# Altium schematic sheet Power.SchDoc
size A4; SheetNumber: 4; SheetTotal: 6
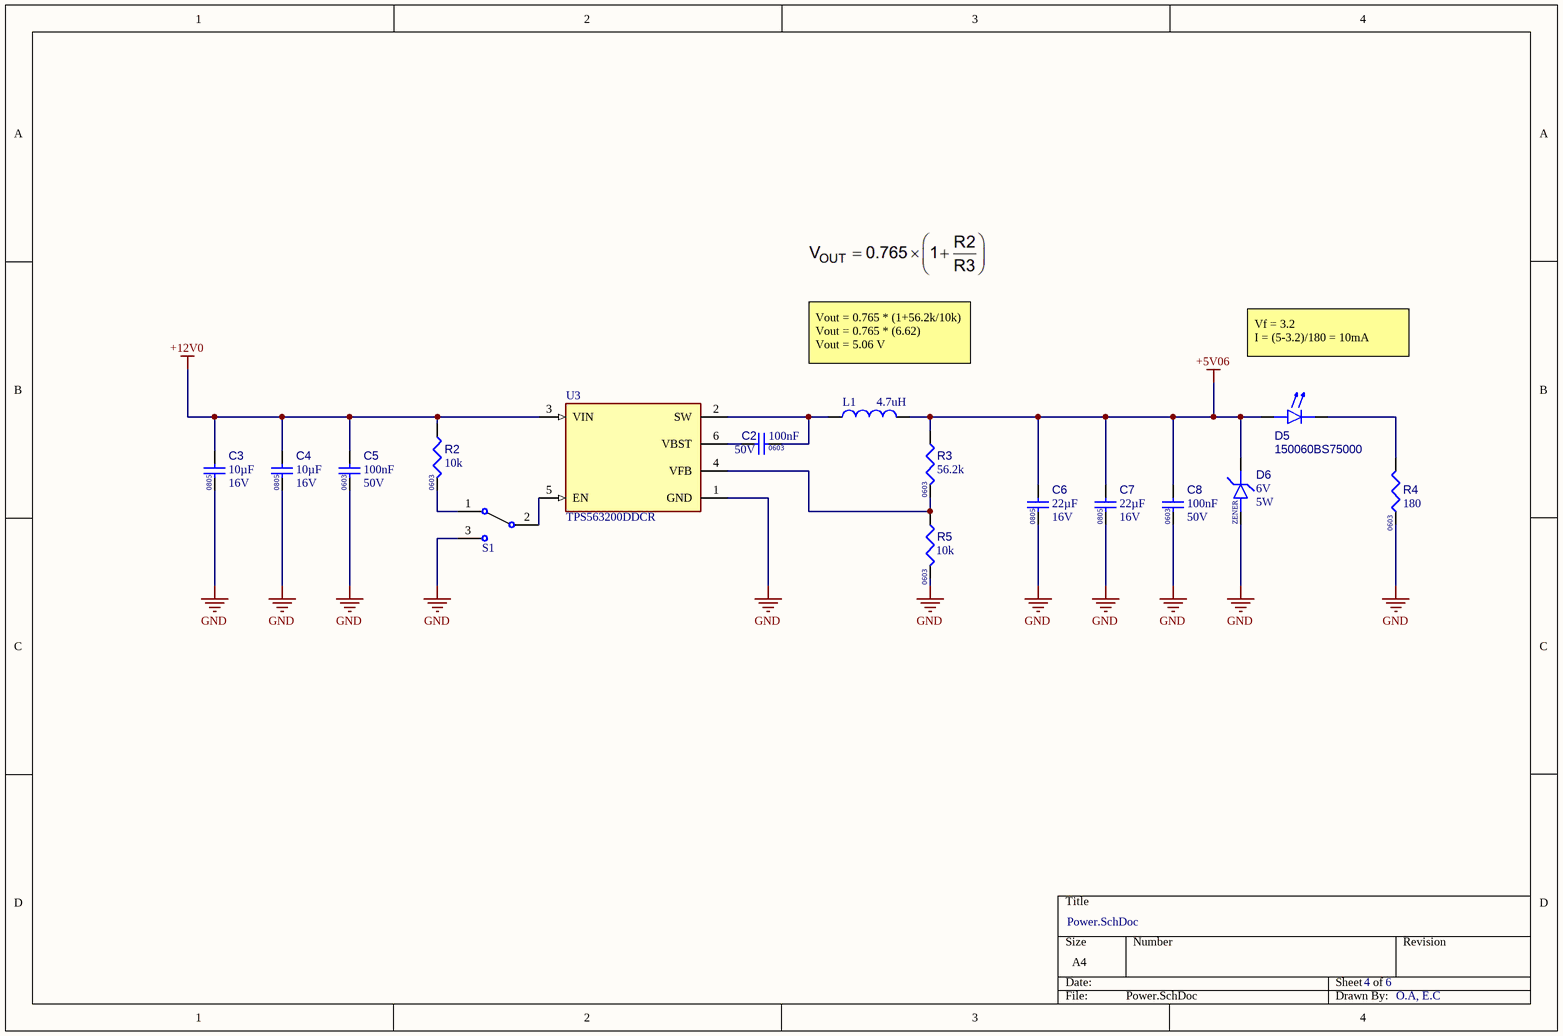
[diagram p0: Power.SchDoc]

## Parts
C2  value 100nF  Voltage Rating: 50V  Case/Package: 0603  [CAPC1608X90X40NL10T20]  (hidden comment: Capacitor 100 nF +/-10% 50 V 0603)
C3  value 10µF  Voltage Rating: 16V  Case/Package: 0805  [CAP CER 10UF 16V X5R 0805-Footprint-1]  (hidden comment: CAP CER 10UF 16V X5R 0805)
C4  value 10µF  Voltage Rating: 16V  Case/Package: 0805  [CAP CER 10UF 16V X5R 0805-Footprint-1]  (hidden comment: CAP CER 10UF 16V X5R 0805)
C5  value 100nF  Voltage Rating: 50V  Case/Package: 0603  [CAPC1608X90X40NL10T20]  (hidden comment: Capacitor 100 nF +/-10% 50 V 0603)
C6  value 22µF  Voltage Rating: 16V  Case/Package: 0805  [CL21A226MOQNNNE-Footprint-1]  (hidden comment: CL21A226MOQNNNE)
C7  value 22µF  Voltage Rating: 16V  Case/Package: 0805  [CL21A226MOQNNNE-Footprint-1]  (hidden comment: CL21A226MOQNNNE)
C8  value 100nF  Voltage Rating: 50V  Case/Package: 0603  [CAPC1608X90X40NL10T20]  (hidden comment: Capacitor 100 nF +/-10% 50 V 0603)
D5  150060BS75000  [WL-SMCW_0603_150060xx75000]
D6  Reference Voltage-Nom: 6V  Max Power Dissipation: 5W  Diode Type: ZENER  [FP-DO-214AA-MFG]  (hidden comment: SMBJ5340B-TP)
L1  Inductance-Nom (L): 4.7uH  [FP-LQH5BPN_38-MFG]  (hidden comment: LQH5BPN4R7N38L)
R2  value 10k  Case/Package: 0603  [RESC1608X55X25NL10T15]  (hidden comment: Resistor 10k +/-1% 0603 100 mW)
R3  value 56.2k  Case/Package: 0603  [RC0603JR-0730KL-Footprint-1]  (hidden comment: RC0603FR-0756K2L)
R4  value 180  Case/Package: 0603  [RESC0603(1608)_N]  (hidden comment: RC0603JR-07180RL)
R5  value 10k  Case/Package: 0603  [RESC1608X55X25NL10T15]  (hidden comment: Resistor 10k +/-1% 0603 100 mW)
S1  SLW-883935-2A-D  [SLW-883935-2A-D-Footprint-1]  (value not drawn)
U3  TPS563200DDCR  [FP-DDC0006A-MFG]

## Nets
+5V06: C6.2 C7.2 C8.2 D5.2(A) D6.1(K) L1.1 R3.2
+12V0: C3.2 C4.2 C5.2 R2.2 U3.3(VIN)
GND: C3.1 C4.1 C5.1 C6.1 C7.1 C8.1 D6.2(A) R4.1 R5.1 S1.3(NO) U3.1(GND)
NetC2_1: C2.1 L1.2 U3.2(SW)
NetC2_2: C2.2 U3.6(VBST)
NetD5_1: D5.1(K) R4.2
NetR2_1: R2.1 S1.1(NC)
NetR3_1: R3.1 R5.2 U3.4(VFB)
NetS1_2: S1.2(COM) U3.5(EN)

## Notes on the sheet
- Vout = 0.765 * (1+56.2k/10k)
  Vout = 0.765 * (6.62)
  Vout = 5.06 V
- Vf = 3.2
  I = (5-3.2)/180 = 10mA
- O.A, E.C

## Library data of the parts
C2 C5 C8 = CMP-001-00017-8: Chip Capacitor, 100 nF, +/- 10%, 50 V, 0603 (1608 Metric); Capacitor Type: Ceramic; Tolerance: 10%; Mounting Technology: SM; Max Operating Temperature: 125°C; RoHS Compliant: True; Pins: 2; Min Operating Temperature: -55°C
C3 C4 = CMP-001-00084-6: Ceramic Capacitor, Multilayer, Ceramic, 16V, 10% +Tol, 10% -Tol, X5R, 15% TC, 10uF, Surface Mount, 0805; Pins: 2; Capacitor Type: Ceramic; Max Operating Temperature: 85°C; Min Operating Temperature: -55°C; RoHS Compliant: Yes; Mounting Technology: Surface Mount
C6 C7 = CMP-001-00087-3: Ceramic Capacitor, Multilayer, Ceramic, 16V, 20% +Tol, 20% -Tol, X5R, 15% TC, 22uF, Surface Mount, 0805; Min Operating Temperature: -55°C; Mounting Technology: Surface Mount; Max Operating Temperature: 85°C; Capacitor Type: Ceramic; Pins: 2; RoHS Compliant: Yes
D5 = CMP-007-00037-2: Single Color LED, Blue, Water Clear, 1.1mm; Nominal Vf: 3.2V; Channels: 1; Luminous Intensity-Nom: 145mcd; Overall Height: 0.7mm; Shape: Rectangular; Viewing Angle: 140°; Forward Current: 30mA; Pins: 2; Lens Style: WATER CLEAR; Mounting Technology: Surface Mount; Optoelectronic Device Type: SINGLE COLOR LED; Packaging: Tape and Reel; Color: Blue; RoHS Compliant: Yes; Colour: Blue; Terminal Pitch: 1.6mm; Min Operating Temperature: -40°C; Size: 1.1mm; Reach SVHC Compliant: Yes; Max Operating Temperature: 85°C
D6 = CMP-004-00036-2: Zener Diode, 6V V(Z), 5%, 5W, Silicon, Unidirectional, DO-214AA; Time @ Peak Reflow Temperature-Max (s): 10s; Test Current: 200mA; Package Body Material: Plastic; Qualification Status: Not Qualified; Dynamic Impedance-Max: 1R; Number of Elements: 1; JEDEC-95 Code: DO-214AA; Min Operating Temperature: -55°C; Package Shape: Rectangular; RoHS Compliant: Yes; Terminal Finish: Tin; Terminal Form: C BEND; Peak Reflow Temperature (Cel): 260°C; Terminal Position: DUAL; Technology: ZENER; JESD-609 Code: e3; Diode Element Material: SILICON; Polarity: Unidirectional; Pins: 2; Voltage Tol-Max: 5%; Moisture Sensitivity Level: 1; Reach SVHC Compliant: No; JESD-30 Code: R-PDSO-C2; Max Operating Temperature: 150°C; Package Style: SMALL OUTLINEMeter; Surface Mount: Yes
L1 = CMP-006-00023-1: General Purpose Inductor, 4.7uH, 30%, 1 Element, Ferrite-Core, SMD, 1919; Max Current Rating: 3.8A; Channels: 1; DC Resistance (DCR): 31.2mR; Self Resonant Frequency: 17MHz; Shielding: Shielded; Shape/Size Description: RECTANGULAR PACKAGE; Test Frequency: 100kHz; Inductor Application: RF INDUCTOR; Tolerance: 30%; Core Material: Ferrite; Min Operating Temperature: -40°C; Pins: 2; Terminal Placement: Dual Ended; RoHS Compliant: Yes; Surface Mount: Yes; Inductor Type: GENERAL PURPOSE INDUCTOR; Termination: One Surface; Reach SVHC Compliant: Yes; Max Operating Temperature: 125°C
R2 R5 = CMP-009-00017-7: Chip Resistor, 10 KOhm, +/- 1%, 01 W, -55 to 155 degC, 0603 (1608 Metric); Voltage Rating: 50V; Power: 100mW; RoHS Compliant: True; Min Operating Temperature: -55°C; Pins: 2; Mounting Technology: SM; Max Operating Temperature: 155°C; Tolerance: 1%
R3 = CMP-009-00192-1: Fixed Resistor, Metal Glaze/thick Film, 0.1W, 56200ohm, 75V, 1% +/-Tol, 100ppm/Cel, Surface Mount, 0603; Package Length: 1.6mm; Additional Feature: LASER TRIMMABLE; Temperature Coefficient: 100ppm/°C; Package Height: 0.45mm; Rated Temperature: 70°C; Package Width: 0.8mm; Power: 100mW; Termination: Wraparound; Reach SVHC Compliant: Yes; Resistor Type: FIXED RESISTOR; JESD-609 Code: e3; Max Operating Temperature: 155°C; Construction: Chip; Terminal Finish: Nickel; Pins: 2; Mounting Technology: Surface Mount; Working Voltage: 75V; RoHS Compliant: Yes; Technology: METAL GLAZE/THICK FILM; Min Operating Temperature: -55°C; Package Shape: Rectangular; Tolerance: 1%; Package Style: SMTMeter; Packaging: Tape and Reel
R4 = CMP-009-00178-1: Fixed Resistor, Metal Glaze/thick Film, 0.1W, 180ohm, 75V, 5% +/-Tol, 100ppm/Cel, Surface Mount, 0603; Power: 100mW; Tolerance: 5%; Pins: 2; Mounting Technology: Surface Mount; RoHS Compliant: Yes; Max Operating Temperature: 155°C; Min Operating Temperature: -55°C
S1 = CMP-011-00017-1: 8.8 X 3.9 X 3.5 Mm, 2 Mm Raised
U3 = CMP-019-00052-1: Switching Regulator, 3A, 650kHz Switching Freq-Max, PDSO6; Switcher Configuration: BUCK; Channels: 1; Package Body Material: Plastic; Max Output current: 5.3A; Max Supply Voltage: 17V; Min Input Voltage: 4.5V; Control Technique: PULSE WIDTH MODULATION; Nominal Supply Voltage: 12V; Reach SVHC Compliant: Yes; RoHS Compliant: Yes; Temperature Grade: INDUSTRIAL; Terminal Finish: Tin; Throw Configuration: SWITCHING REGULATOR; Terminal Pitch: 0.95mm; Terminal Position: DUAL; Frequency: 650kHz; JESD-30 Code: R-PDSO-G6; Surface Mount: Yes; Min Operating Temperature: -40°C; Pins: 6; Peak Reflow Temperature (Cel): 260°C; JESD-609 Code: e3; Package Style: SMALL OUTLINE, THIN PROFILE, SHRINK PITCHMeter; Length: 2.9mm; Max Operating Temperature: 85°C; Width: 1.6mm; Package Shape: Rectangular; Terminal Form: Gull Wing; Case/Package: TSSOP; Height - Seated (Max): 1.1mm; Moisture Sensitivity Level: 1